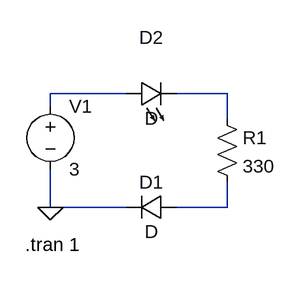
[diagram p0: schematic Forward bias.asc]
Forward bias.asc, the LTspice schematic file:
Version 4
SHEET 1 880 680
WIRE 80 80 -16 80
WIRE 208 80 144 80
WIRE -16 96 -16 80
WIRE 208 112 208 80
WIRE -16 224 -16 176
WIRE 80 224 -16 224
WIRE 208 224 208 192
WIRE 208 224 144 224
FLAG -16 224 0
SYMBOL res 192 96 R0
SYMATTR InstName R1
SYMATTR Value 330
SYMBOL diode 144 208 R90
WINDOW 0 0 32 VBottom 2
WINDOW 3 32 32 VTop 2
SYMATTR InstName D1
SYMBOL LED 80 96 R270
WINDOW 0 72 32 VTop 2
WINDOW 3 0 32 VBottom 2
SYMATTR InstName D2
SYMBOL voltage -16 80 R0
WINDOW 123 0 0 Left 0
WINDOW 39 0 0 Left 0
SYMATTR InstName V1
SYMATTR Value 3
TEXT -48 272 Left 2 !.tran 1

The netlist it stands for:
* Forward bias.asc
R1 N002 N003 330
D1 N003 0 D
D2 N001 N002 D
V1 N001 0 3
.model D D
.lib standard.dio
.tran 1
.backanno
.end